# Altium schematic sheet Current_Measurement_CAS5000.SchDoc
size A4; CompanyName: Technische Hochschule Nürnberg Georg Simon Ohm; Organization: UltraZohm; Address1: Kesslerplatz 12; Address2: 90489 Nürnberg; Address3: GERMANY; Website: www.ultrazohm.com
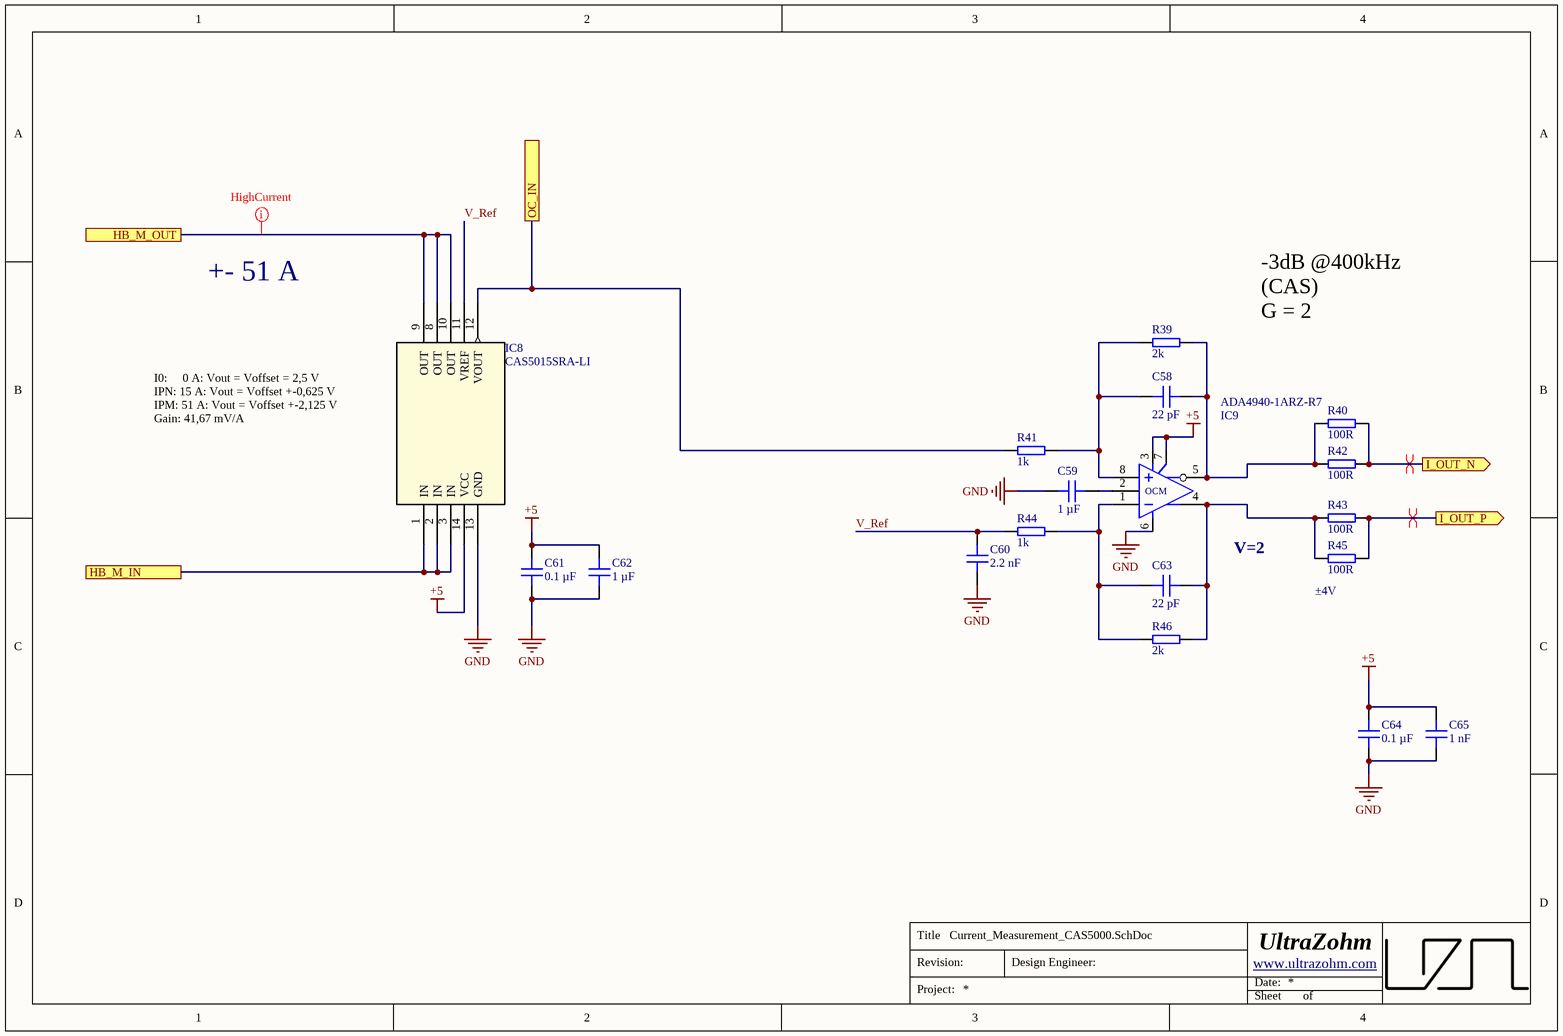
[diagram p0: Current_Measurement_CAS5000.SchDoc]

## Parts
C58  22 pF  [C_0603]
C59  1 µF  [C_0603]
C60  2.2 nF  [C_0603]
C61  0.1 µF  [C_0603]
C62  1 µF  [C_0603]
C63  22 pF  [C_0603]
C64  0.1 µF  [C_0603]
C65  1 nF  [C_0603]
IC8  CAS5015SRA-LI  [CAS50xxSRA]
IC9  ADA4940-1ARZ-R7  [SOIC-8-N]
R39  2k  [RES 0603_1608]
R40  100R  [RES 0603_1608]
R41  1k  [RES 0603_1608]
R42  100R  [RES 0603_1608]
R43  100R  [RES 0603_1608]
R44  1k  [RES 0603_1608]
R45  100R  [RES 0603_1608]
R46  2k  [RES 0603_1608]

## Ports
HB_M_IN, HB_M_OUT, I_OUT_N (out), I_OUT_P (out), OC_IN

## Nets
+5: C61.2 C62.1 C64.2 C65.2 IC8.14(VCC) IC9.3(V+) IC9.7(EN)
GND: C59.1 C60.1 C61.1 C62.2 C64.1 C65.1 IC8.13(GND) IC9.6(V-)
HB_M_IN: IC8.1(IN) IC8.2(IN) IC8.3(IN) ; port HB_M_IN
HB_M_OUT: IC8.8(OUT) IC8.9(OUT) IC8.10(OUT) ; port HB_M_OUT
I_OUT_N: R40.2 R42.2 ; port I_OUT_N
I_OUT_P: R43.2 R45.2 ; port I_OUT_P
OC_IN: IC8.12(VOUT) R41.1 ; port OC_IN
V_Ref: C60.2 IC8.11(VREF) R44.1
NetC58_1: C58.1 IC9.8(+) R39.1 R41.2
NetC58_2: C58.2 IC9.5(Out) R39.2 R40.1 R42.1
NetC59_2: C59.2 IC9.2(OCM)
NetC63_1: C63.1 IC9.1(-) R44.2 R46.1
NetC63_2: C63.2 IC9.4(Out) R43.1 R45.1 R46.2

## Layout directives
mark named HighCurrent: HB_M_OUT
differential pair: I_OUT_N, I_OUT_P

## Notes on the sheet
- +- 51 A
- -3dB @400kHz (CAS)
  G = 2
  VoutP-VoutN= +-5V
- I0:     0 A: Vout = Voffset = 2,5 V
  IPN: 15 A: Vout = Voffset +-0,625 V
  IPM: 51 A: Vout = Voffset +-2,125 V
  Gain: 41,67 mV/A
- V=2
- (near R45) ±4V
- Title
- Revision:
- Design Engineer:
- Date:
- Project:
- Sheet
- of

## Library data of the parts
C58 C63 = C0603C220J5RACTU: Capacitor 0603, 50 VDC, 22 pF, X7R; Manufacturer: KEMET; Tolerance: 5 %; Voltage Rating: 50 VDC; Created from: MGremer; Manufacturer Part Number: C0603C220J5RACTU; PartID: 78; Created On: 20.12.2020 13:54:13; ComponentLink1Description: Datasheet; ComponentLink1URL: https://www.mouser.de/datasheet/2/212/KEM_C1002_X7R_SMD-1102033.pdf; Component Type: Capacitor 0603; Device Package: 0603; Last Updated: 20.01.2021 13:57:36; Mounting Type: SMD; Operating Temperature: -55 - 125°C; Series: SMD Comm X7R; Supplier 1: Mouser; Supplier Part Number 1: 80-C0603C220J5R; Type: Capacitor; Value: 22 pF; Live Cycle Status: 1; Stock number: not stored
C59 C62 = UMK107AB7105KA-T: 50V 1uF X7R ±10% 0603 Multilayer Ceramic Capacitors MLCC - SMD/SMT ROHS; Manufacturer: Taiyo Yuden; Voltage Rating: 50 VDC; Created from: NDiringer; Manufacturer Part Number: UMK107AB7105KA-T; PartID: 98; Created On: 09.08.2022 09:35:02; ComponentLink1Description: Datasheet; ComponentLink1URL: https://www.mouser.de/datasheet/2/396/mlcc02_e-1307760.pdf; Component Type: Capacitor 0603; Device Package: 0603; Last Updated: 21.09.2022 16:11:37; Mounting Type: SMD; Operating Temperature: -55 - 125°C; Series: X7R; Supplier 1: LCSC; Supplier Part Number 1: C105174; Supplier 2: Mouser; Supplier Part Number 2: 963-UMK107AB7105MA-T; Type: Capacitor; Tolerance: 10 %; Value: 1 µF; Live Cycle Status: 1; LCSC Part Number: C105174; Stock number: not stored
C60 = 06035C222JAT2A: Capacitor 0603, 50 VDC, 2.2 nF, X7R; Manufacturer: AVX; Tolerance: 5 %; Voltage Rating: 50 VDC; Created from: MGremer; Manufacturer Part Number: 06035C222JAT2A; PartID: 77; Created On: 20.12.2020 13:54:13; ComponentLink1Description: Datasheet; ComponentLink1URL: https://www.mouser.de/datasheet/2/40/X7RDielectric-777024.pdf; Component Type: Capacitor 0603; Device Package: 0603; Last Updated: 15.02.2023 17:14:22; Mounting Type: SMD; Operating Temperature: -55 - 125°C; Series: MLCC X7R; Supplier 1: Mouser; Supplier Part Number 1: 581-06035C222J; Type: Capacitor; Value: 2.2 nF; Live Cycle Status: 1; Stock number: not stored; Supplier Part Number 2: C86023; Supplier 2: LCSC
C61 C64 = C0603X104K5RAC7411: Capacitor 0603, 50 VDC, 0.1 µF, X7R; Manufacturer: KEMET; Tolerance: 10 %; Voltage Rating: 50 VDC; Created from: MGremer; Manufacturer Part Number: C0603X104K5RAC7411; PartID: 3; Created On: 20.12.2020 13:54:13; ComponentLink1Description: Datasheet; ComponentLink1URL: https://www.mouser.de/datasheet/2/212/1/KEM_C1013_X7R_FT_CAP_SMD-1103280.pdf; Component Type: Capacitor 0603; Device Package: 0603; Last Updated: 04.03.2021 09:24:28; Mounting Type: SMD; Operating Temperature: -55 - 125°C; Series: SMD Comm X7R Flex; Supplier 1: Mouser; Supplier Part Number 1: 80-C0603X104K5R7411; Supplier 2: LCSC; Supplier Part Number 2: C14663; Type: Capacitor; Value: 0.1 µF; Live Cycle Status: 1; LCSC Part Number: C14663; Stock number: Labor SMD Container
C65 = CC0603JRNPO9BN102: Capacitor 0603, 50 VDC, 1 nF, NP0; Manufacturer: YAGEO; Tolerance: 5 %; Voltage Rating: 50 VDC; Created from: AGeiger; Manufacturer Part Number: CC0603JRNPO9BN102; PartID: 104; Created On: 30.08.2022 11:46:28; ComponentLink1Description: Datasheet; ComponentLink1URL: https://datasheet.lcsc.com/lcsc/1811021411_YAGEO-CC0603JRNPO9BN102_C106246.pdf; Component Type: Capacitor 0603; Device Package: 0603; Last Updated: 30.08.2022 11:46:28; Mounting Type: SMD; Operating Temperature: -55 - 125°C; Series: NP0; Supplier 1: LCSC; Supplier Part Number 1: C106246; Type: Capacitor; Value: 1 nF; Live Cycle Status: 1; LCSC Part Number: C106246
IC8 = CAS5015SRA-LI: 15A, 1.1%, 400kHz; Mfr_Name: LEM; Manufacturer_Part_Number: CASR 15-NP; Manufacturer: Sensitec; Created from: VStarost; Copyright: Copyright (C) 2022 Ultra Librarian. All rights reserved.; Digi-Key_Part_Number_1: 398-1092-5-ND; Digi-Key_Part_Number_2: 398-1092-5-NDL; Digi-Key_Part_Number_3: 398-1092-ND; RefDes: RefDes; Type: Current Sensor; Manufacturer Part Number: CAS5015SRA-LI; PartID: 3; Created On: 10.02.2023 10:35:26; ComponentLink1Description: Datasheet; ComponentLink1URL: https://www.sensitec.com/fileadmin/sensitec/Service_and_Support/Downloads/Data_Sheets/CAS5000/SENSITEC_CAS5000-Series_DSE_01.pdf; Component Type: TMR-Current Sensor; Device Package: THT; Last Updated: 10.02.2023 10:35:26; Mounting Type: THT; Operating Temperature: -40 - 105°C; Series: CAS5000; Supplier 1: RS; Supplier Part Number 1: 216-9746; Value: 15A; Live Cycle Status: 1; Stock number: not stocked
IC9 = ADA4940-1ARZ-R7: Differential ADC Driver; Manufacturer: Analog Devices; Class I: Analog; Class II: Fully Differential ADC Drivers (-40-125°C); Best.-Nr.: Farnell 209-6178; Channels: 1; Created from: MGremer; Datasheet: DSO11449, Ver. Aug 2000; Last edited: 04.01.2007 10:14; Package Reference: SOIC-N-8; Manufacturer Part Number: ADA4940-1ARZ-R7; PartID: 3; Created On: 15.01.2021 12:16:53; ComponentLink1Description: Datasheet; ComponentLink1URL: https://www.mouser.de/datasheet/2/609/ADA4940-1_4940-2-878284.pdf; Component Type: ADC; Device Package: SOIC-8; Last Updated: 22.11.2021 15:19:18; Mounting Type: SMD; Operating Temperature: -40 - 105 °C; Supplier 1: Mouser; Supplier Part Number 1: 584-ADA4940-1ARZ-R7; Type: ADC; Resolution: -; Value: differential ADC driver; Live Cycle Status: 1; Stock number: not stored
R39 R46 = ERA-3VEB2001V: SMD resistor 0.1%; Manufacturer: Panasonic; Created from: MGremer; Manufacturer Part Number: ERA-3VEB2001V; PartID: 187; Created On: 14.12.2020 16:17:14; ComponentLink1Description: Datasheet; ComponentLink1URL: https://www.mouser.de/datasheet/2/315/Panasonic_Resistor_Thin_Film_(ERA-xV_2c_ERA-xK_Ser-1815278.pdf; Component Type: SMD resistor; Device Package: 0603; Last Updated: 15.02.2023 17:45:34; Mounting Type: SMD; Supplier 1: Mouser; Supplier Part Number 1: 667-ERA-3VEB2001V; Type: Resistor; Tolerance: 0.1%; Value: 2k; Live Cycle Status: 1; Stock number: not stored; LCSC Part Number: C318130
R40 R42 R43 R45 = RK73B1JTTD101J: SMD resistor E24 series; Manufacturer: KOA Speer; Tolerance: 5%; Created from: MGremer; Manufacturer Part Number: RK73B1JTTD101J; PartID: 50; Created On: 14.12.2020 16:17:14; ComponentLink1Description: Datasheet; ComponentLink1URL: https://www.mouser.de/datasheet/2/219/RK73B-1825463.pdf; Component Type: SMD resistor; Device Package: 0603; Last Updated: 29.11.2022 14:30:07; Mounting Type: SMD; Supplier 1: Mouser; Supplier Part Number 1: 660-RK73B1JTTD101J; Supplier 2: LCSC; Supplier Part Number 2: C22775; Type: Resistor; Value: 100R; Live Cycle Status: 1; Stock number: Labor SMD Container; LCSC Part Number: C22775
R41 R44 = RC0603FR-071KL: SMD resistor 1%; Manufacturer: YAGEO; Created from: MGremer; Manufacturer Part Number: RC0603FR-071KL; PartID: 177; Created On: 14.12.2020 16:17:14; ComponentLink1Description: Datasheet; ComponentLink1URL: http://www.farnell.com/datasheets/2860681.pdf; Component Type: SMD resistor; Device Package: 0603; Last Updated: 15.02.2023 17:36:12; Mounting Type: SMD; Supplier 1: Farnell; Supplier Part Number 1: 9238484; Type: Resistor; Tolerance: 1%; Value: 1k; Live Cycle Status: 1; Stock number: not stored; LCSC Part Number: C3016283